# Altium schematic sheet mcu.SchDoc
size 292 x 204 mm; ProjectSection: Set ProjectSection in Document Parameters; PageSetup: Record=PageOptions|CenterHorizontal=True|CenterVertical=True|PrintScale=1.00|XCorrection=1.00|YCorrection=1.00|PrintKind=1|BorderSize=5000000|LeftOffset=0|BottomOffset=0|Orientation=2|PaperLength=1000|PaperWidth=1000|Scale=100|PaperSource=7|PrintQuality=1200|MediaType=1|DitherType=10|PaperKind=A4|PrintScaleMode=1
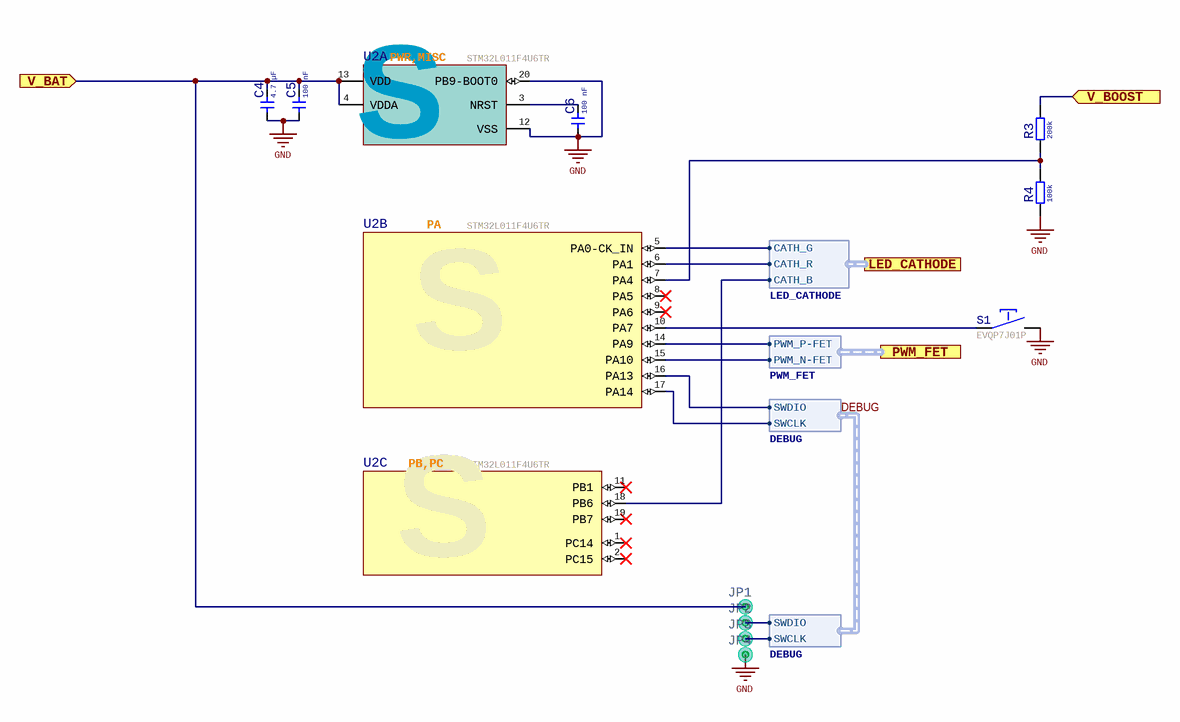
[diagram p0: mcu.SchDoc]

## Parts
C4  value 4.7 µF  [1608C]  (hidden comment: CAP-NP)
C5  value 100 nF  [1005C]  (hidden comment: CAP-NP)
C6  value 100 nF  [1005C]  (hidden comment: CAP-NP)
JP1  CON-01-TESTPOINT  [CON-01-PAD-0.75MM-RND]  (value not drawn)  (no BOM)
JP2  CON-01-TESTPOINT  [CON-01-PAD-0.75MM-RND]  (value not drawn)  (no BOM)
JP3  CON-01-TESTPOINT  [CON-01-PAD-0.75MM-RND]  (value not drawn)  (no BOM)
JP4  CON-01-TESTPOINT  [CON-01-PAD-0.75MM-RND]  (value not drawn)  (no BOM)
R3  value 200k  [1005R]  (hidden comment: RES)
R4  value 100k  [1005R]  (hidden comment: RES)
S1  Manufacturer P/N: EVQP7J01P  [SWI-PU-EVQP7x01P-Panasonic]  (hidden comment: SWI-PU)
U2  Manufacturer P/N: STM32L011F4U6TR  [IC-STM32L011FxUx-UFQFPN20]  (hidden comment: STM32L011FxUx)  (parts A,B,C of 3)

## Ports
LED_CATHODE (harness LED_CATHODE), PWM_FET (harness PWM_FET), V_BAT (in), V_BOOST (in)

## Harnesses
LED_CATHODE: CATH_R, CATH_B, CATH_G
PWM_FET: PWM_P-FET, PWM_N-FET
DEBUG: SWDIO, SWCLK

## Nets
GND: C4.1 C5.1 C6.1 JP4.1 R4.1 S1.2 U2.12(VSS) U2.20(PB9-BOOT0)
DEBUG.SWCLK: JP3.1 U2.17(PA14) ; harness DEBUG.SWCLK
DEBUG.SWDIO: JP2.1 U2.16(PA13) ; harness DEBUG.SWDIO
V_BAT: C4.2 C5.2 JP1.1 U2.4(VDDA) U2.13(VDD) ; port V_BAT
V_BOOST: R3.2 ; port V_BOOST
NetC6_2: C6.2 U2.3(NRST)
NetR3_1: R3.1 R4.2 U2.7(PA4)
NetS1_1: S1.1 U2.10(PA7)
NetU2_5: U2.5(PA0-CK_IN) ; port LED_CATHODE.CATH_G
NetU2_6: U2.6(PA1) ; port LED_CATHODE.CATH_R
NetU2_14: U2.14(PA9) ; port PWM_FET.PWM_P-FET
NetU2_15: U2.15(PA10) ; port PWM_FET.PWM_N-FET
NetU2_18: U2.18(PB6) ; port LED_CATHODE.CATH_B

Not connected (* = marked no-connect by the designer): U2 1(PC14)* 2(PC15)* 8(PA5)* 9(PA6)* 11(PB1)* 19(PB7)*

## Notes on the sheet
- Project
- Customer
- File Name
- Part
- Section
- Revision (File)
- Variant
- Revision (Project)
- Date
- Sheet
- Contronix GmbH
- Nizzastr. 6, 01445 Radebeul
- (in symbol STM32L011F4U6, part A) PWR,MISC; S
- (in symbol STM32L011F4U6, part B) PA; S
- (in symbol STM32L011F4U6, part C) PB,PC; S

## Library data of the parts
C4 = CAP-4u7-6V3-10%-X5R-1608: SMD ceramic capacitor, X5R; Manufacturer: Kemet; Manufacturer P/N: C0603C475K9PACTU; hasAltManufacturer: 0; Contronix P/N: CVXZ75; autIdem: 255; NozzleType: 701/901; FeederType: Tape 8mm; FeederPitch: 4mm; NumberOfPins: 2; NumberOfRows: 1; Voltage: 6,3; Tolerance: 10%; PackageCNTX: 1608; CapacitanceSI: 4,7E-6; Design Item Id: CAP-4u7-6V3-10%-X5R-1608; Stock: 84; Price: 0,11; Price (€): 0,11; A I: 255; ComponentLink1Description: Manufacturer Datasheet; Supplier 1: Digi-Key; Supplier Part Number 1: 399-3482-1-ND; Created: 08.08.2013 14:56:01; Modified: 18.02.2020 17:38:33; Obsolete: 0; Voltage (V): 6,3; PackageManufacturer: 1608; Material: X5R; MountingType: SMT; polarized: 0; Manufacturer Part Number: C0603C475K9PACTU
C5 C6 = CAP-100n-6V3-10%-X7R-1005: SMD ceramic capacitor, X7R; Manufacturer: Samsung Electro-Mechanics America, Inc.; Manufacturer P/N: CL05B104KQ5NNNC; hasAltManufacturer: 0; Contronix P/N: CANCYL; autIdem: 255; NozzleType: 701/901; FeederType: Tape 8mm; FeederPitch: 2mm; NumberOfPins: 2; NumberOfRows: 1; Voltage: 6,3; Tolerance: 10%; PackageCNTX: 1005; CapacitanceSI: 1E-7; Design Item Id: CAP-100n-6V3-10%-X7R-1005; Stock: 2023; Price: 0,0034; Price (€): 0,0034; A I: 255; ComponentLink1Description: Manufacturer Datasheet; ComponentLink1URL: https://content.kemet.com/datasheets/KEM_C1002_X7R_SMD.pdf; Supplier 1: RS; Supplier Part Number 1: 8015145P; Created: 16.11.2015 10:28:12; Modified: 30.10.2019 13:11:15; Obsolete: 0; Voltage (V): 6,3; PackageManufacturer: 1005; Material: X7R; MountingType: SMT; polarized: 0; Manufacturer Part Number: CL05B104KQ5NNNC
JP1-JP4 = CON-01-PAD-0.75MM-RND: 0.75 mm Pad; hasAltManufacturer: 0; Contronix P/N: JTW3SH; Design Item Id: CON-01-PAD-0.75MM-RND; Price: 0; Price (€): 0; autIdem: 0; A I: 0; Created: 20.10.2015 12:13:56; Modified: 13.02.2020 13:28:49; Obsolete: 0
R3 = RES-200k-1%-1005: SMD resistor; Manufacturer: Samsung Electro-Mechanics America, Inc.; Manufacturer P/N: RC1005F204CS; hasAltManufacturer: 0; Contronix P/N: RWVK9S; autIdem: 255; NozzleType: 701/901; FeederType: Tape 8mm; FeederPitch: 2mm; PackageCNTX: 1005; NumberOfPins: 2; NumberOfRows: 1; ResistanceSI: 200000; Tolerance: 1%; Power: 0,063; Design Item Id: RES-200k-1%-1005; Stock: 865; Price: 0,013; Price (€): 0,013; A I: 255; ComponentLink1Description: Manufacturer Datasheet; ComponentLink1URL: http://www.samsungsem.com/global/support/library/product-catalog/__icsFiles/afieldfile/2015/01/12/CHIP_RESISTOR_150112_1.pdf; Supplier 1: Digi-Key; Supplier Part Number 1: 1276-3449-1-ND; Created: 17.06.2015 09:33:35; Modified: 08.10.2019 17:16:22; Obsolete: 0; PackageManufacturer: 1005; Resistance: 200k; MountingType: SMT; Manufacturer Part Number: RC1005F204CS
R4 = RES-100k-1%-0.063W-1005: SMD resistor; Manufacturer: Yageo; Manufacturer P/N: RC0402FR-07100KL; hasAltManufacturer: 0; Contronix P/N: R4P27U; autIdem: 255; NozzleType: 701/901; FeederType: Tape 8mm; FeederPitch: 2mm; PackageCNTX: 1005; NumberOfPins: 2; NumberOfRows: 1; ResistanceSI: 100000; Tolerance: 1%; Power: 0,063; Design Item Id: RES-100k-1%-0.063W-1005; Stock: 151; Price: 0,09; Price (€): 0,09; A I: 255; ComponentLink1Description: Manufacturer Datasheet; ComponentLink1URL: http://www.seielect.com/Catalog/SEI-RMC.pdf; Supplier 1: Mouser; Supplier Part Number 1: 603-RC0402FR-07100KL; Supplier 2: Digi-Key; Supplier Part Number 2: 311-100KLRCT-ND; Supplier 3: Digi-Key; Supplier Part Number 3: 311-100KLRCT-ND; Modified: 26.06.2020 15:46:35; Obsolete: 0; PackageManufacturer: 1005; Resistance: 100k; MountingType: SMT; Manufacturer Part Number: RC0402FR-07100KL
S1 = SWI-PU-EVQP7J01P-Panasonic: SMD Push Button, Right Angle; hasAltManufacturer: 0; Contronix P/N: SGUKDA; NumberOfPins: 4; NumberOfRows: 2; Design Item Id: SWI-PU-EVQP7J01P-Panasonic; Manufacturer: Panasonic; Stock: 0; Price: 0,28; Price (€): 0,28; Supplier 1: Mouser; Supplier Part Number 1: 667-EVQP7J01P; Supplier 2: Digi-Key; Supplier Part Number 2: P16767CT-ND; Created: 28.03.2018 19:53:29; Modified: 01.07.2020 16:17:19; Obsolete: 0; Type: Pushbutton SPST; MountingType: SMT; Manufacturer Part Number: EVQP7J01P
U2 = STM32L011F4U6: Ultra-low-power ARM Cortex-M0+ MCU with 16-Kbytes Flash, 32 MHz CPU; Manufacturer: ST Microelectronics; hasAltManufacturer: 0; Contronix P/N: UY5WXY; NozzleType: 711/911; FeederType: Tape 12mm; FeederPitch: 8mm; PackageCNTX: UFQFPN20; NumberOfPins: 20; NumberOfRows: 4; VoltageMin: 1,65; VoltageMax: 3,6; Flash: 16; RAM: 2; EEPROM: 512; I2C: 1; GPIOs: 28; ADCchannels: 10; ADCbits: 12; Rev: =VersionControl_RevNumber; Design Item Id: STM32L011F4U6; Stock: 3; Price: 1,4; Price (€): 1,4; ComponentLink1Description: Manufacturer Datasheet; ComponentLink1URL: http://www.st.com/content/ccc/resource/technical/document/datasheet/42/c0/ab/e5/71/7a/47/0b/DM00206508.pdf/files/DM00206508.pdf/jcr:content/translations/en.DM00206508.pdf; Supplier 1: Mouser; Supplier Part Number 1: 511-STM32L011F4U6TR; Supplier 2: Digi-Key; Supplier Part Number 2: 497-17478-1-ND; Created: 20.11.2017 15:08:31; Modified: 21.06.2018 19:27:00; Obsolete: 0; PackageManufacturer: UFQFPN20; Core: Cortex-M0+; USART: 1; SPI: 1; MountingType: SMT; Manufacturer Part Number: STM32L011F4U6TR